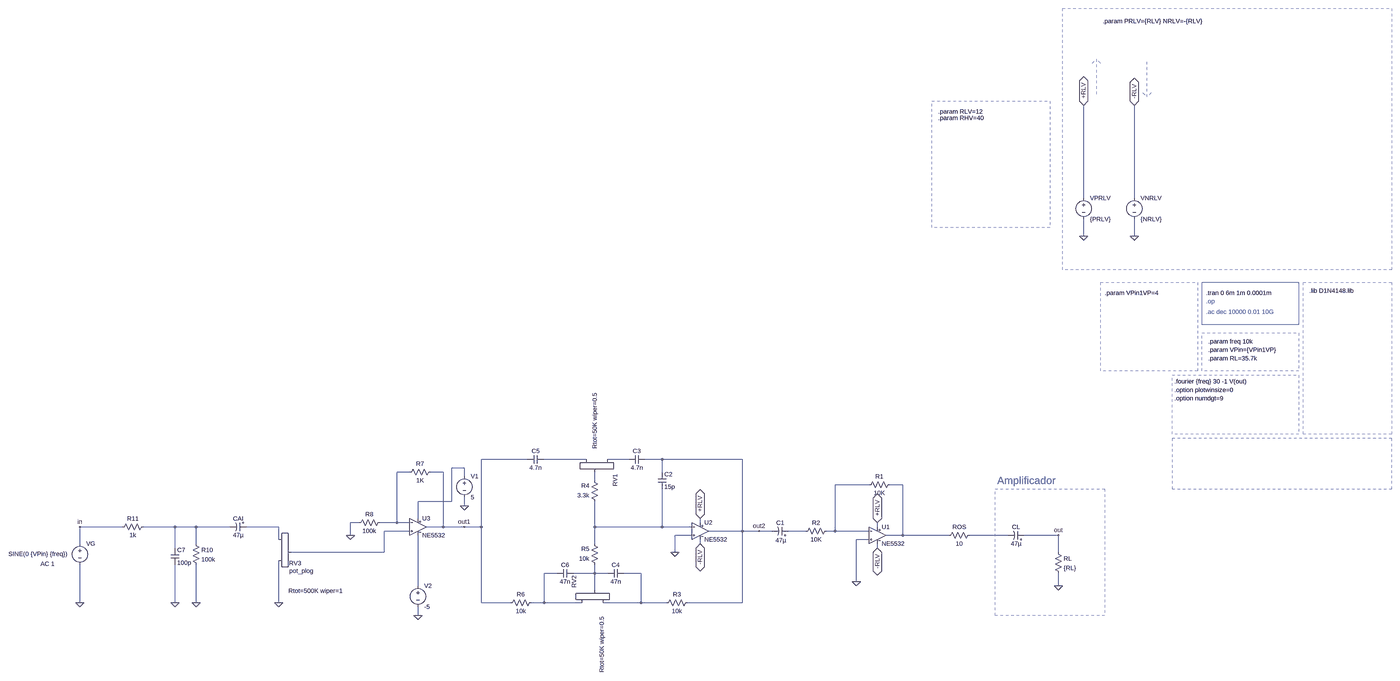
[diagram p0: schematic preamp_V0.1b.asc, whole sheet]
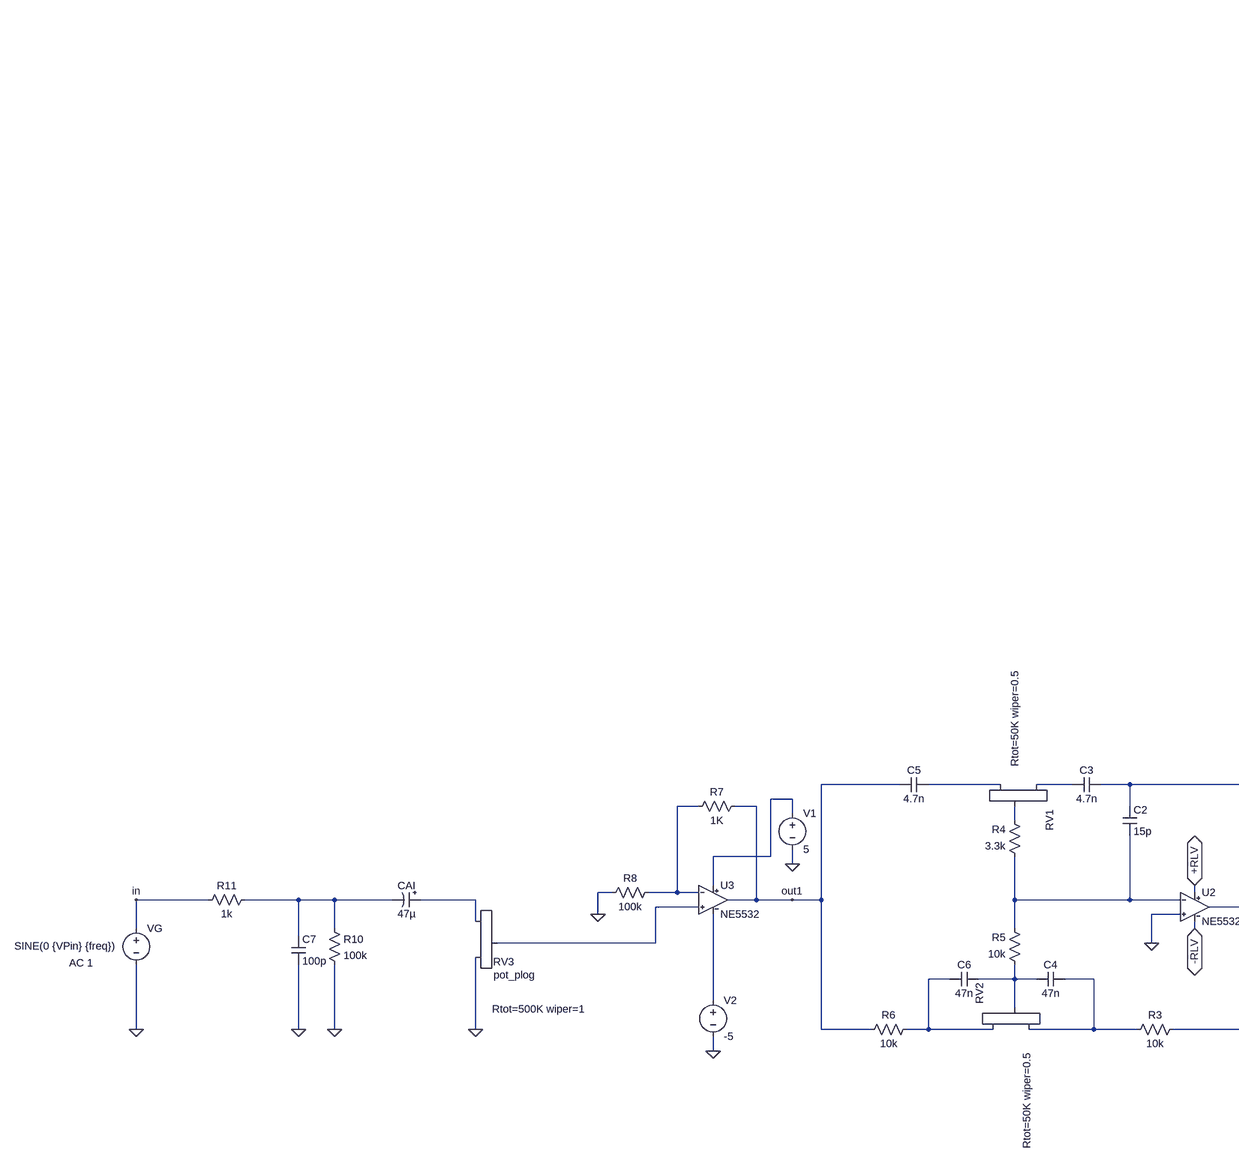
[diagram p1: schematic preamp_V0.1b.asc, part, row 1 of 1, column 1 of 2]
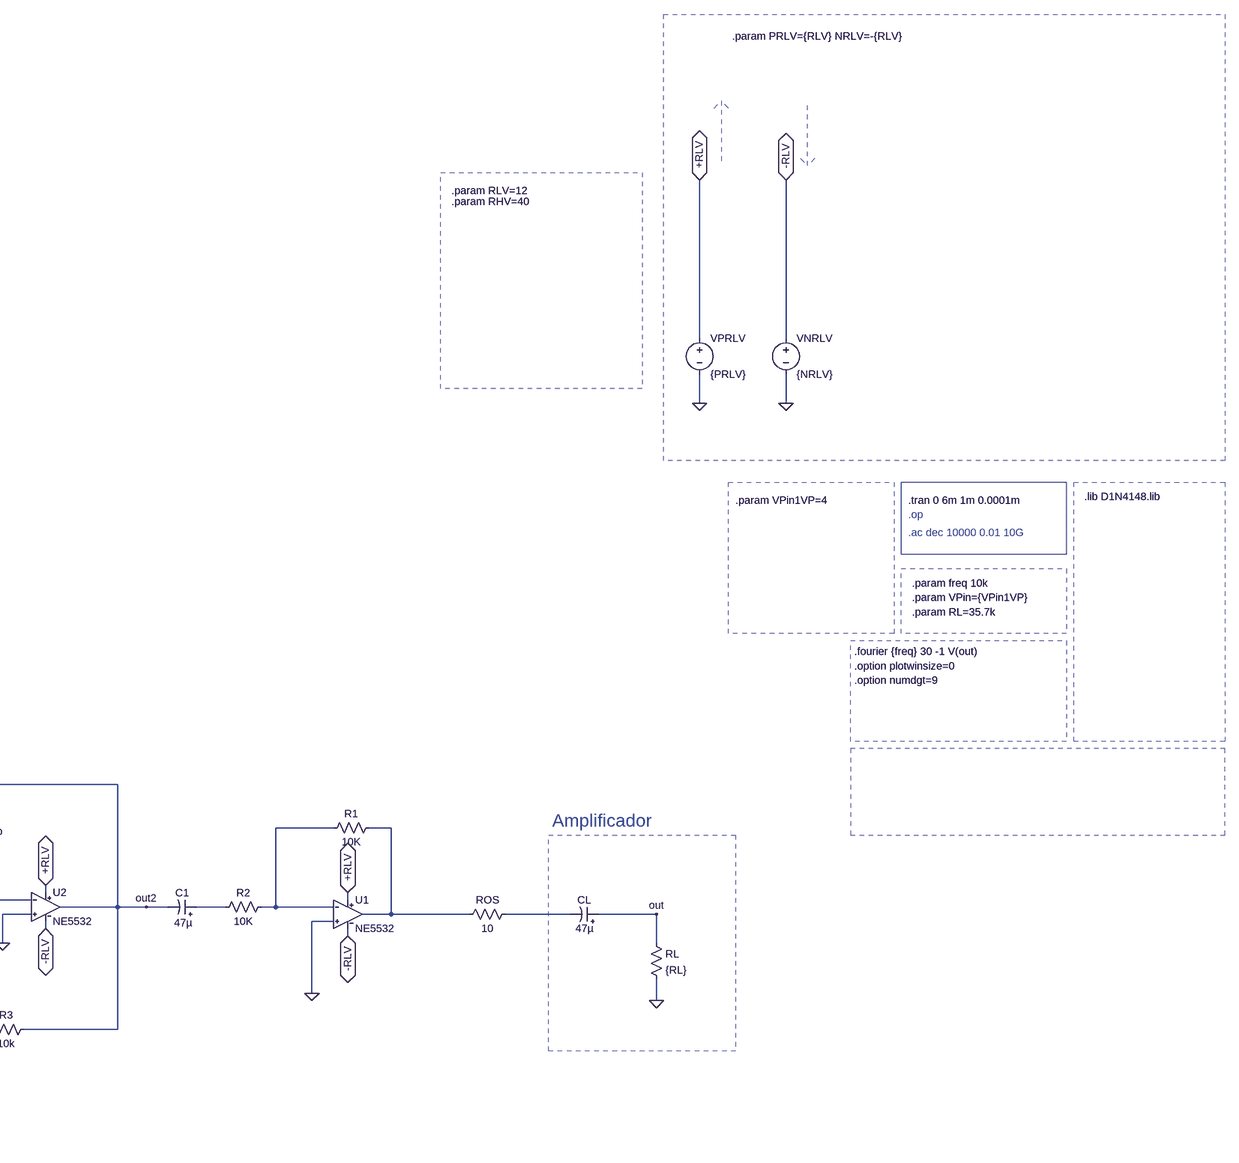
[diagram p2: schematic preamp_V0.1b.asc, part, row 1 of 1, column 2 of 2]
preamp_V0.1b.asc, the LTspice schematic file:
Version 4
SHEET 1 4212 2620
WIRE 1792 -1328 1792 -1680
WIRE 1984 -1328 1984 -1680
WIRE 1792 -1184 1792 -1248
WIRE 1984 -1184 1984 -1248
WIRE -320 -336 -496 -336
WIRE -96 -336 -256 -336
WIRE 64 -336 -16 -336
WIRE 192 -336 128 -336
WIRE 496 -336 192 -336
WIRE -560 -304 -608 -304
WIRE -768 -288 -816 -288
WIRE -640 -288 -688 -288
WIRE 192 -288 192 -336
WIRE -560 -272 -560 -304
WIRE -64 -256 -64 -288
WIRE 976 -240 848 -240
WIRE 1104 -240 1056 -240
WIRE -608 -176 -608 -304
WIRE -608 -176 -736 -176
WIRE -560 -160 -560 -192
WIRE -736 -112 -736 -176
WIRE -960 -96 -992 -96
WIRE -816 -96 -816 -288
WIRE -816 -96 -880 -96
WIRE -768 -96 -816 -96
WIRE 336 -96 336 -112
WIRE -1872 -80 -2048 -80
WIRE -1664 -80 -1792 -80
WIRE -1584 -80 -1664 -80
WIRE -1456 -80 -1584 -80
WIRE -1264 -80 -1392 -80
WIRE -640 -80 -640 -288
WIRE -640 -80 -704 -80
WIRE -560 -80 -640 -80
WIRE -496 -80 -496 -336
WIRE -496 -80 -560 -80
WIRE -64 -80 -64 -176
WIRE 192 -80 192 -224
WIRE 192 -80 -64 -80
WIRE 304 -80 192 -80
WIRE 1008 -80 1008 -96
WIRE -768 -64 -864 -64
WIRE 496 -64 496 -336
WIRE 496 -64 368 -64
WIRE 560 -64 496 -64
WIRE 608 -64 560 -64
WIRE 736 -64 672 -64
WIRE 848 -64 848 -240
WIRE 848 -64 816 -64
WIRE 976 -64 848 -64
WIRE -992 -48 -992 -96
WIRE 304 -48 240 -48
WIRE 1104 -48 1104 -240
WIRE 1104 -48 1040 -48
WIRE 1280 -48 1104 -48
WIRE 1504 -48 1360 -48
WIRE 1696 -48 1568 -48
WIRE -1264 -32 -1264 -80
WIRE 976 -32 928 -32
WIRE -2048 -16 -2048 -80
WIRE -1584 -16 -1584 -80
WIRE -64 -16 -64 -80
WIRE 336 -16 336 -32
WIRE -1664 0 -1664 -80
WIRE 1008 0 1008 -16
WIRE -864 16 -864 -64
WIRE -864 16 -1216 16
WIRE 240 16 240 -48
WIRE 1696 16 1696 -48
WIRE -208 96 -256 96
WIRE -64 96 -64 64
WIRE -64 96 -144 96
WIRE -16 96 -64 96
WIRE 112 96 48 96
WIRE 928 128 928 -32
WIRE -736 144 -736 -48
WIRE 1696 144 1696 96
WIRE -64 160 -64 96
WIRE -2048 208 -2048 64
WIRE -1664 208 -1664 64
WIRE -1584 208 -1584 64
WIRE -1264 208 -1264 48
WIRE -496 208 -496 -80
WIRE -384 208 -496 208
WIRE -256 208 -256 96
WIRE -256 208 -304 208
WIRE -112 208 -256 208
WIRE 112 208 112 96
WIRE 112 208 -32 208
WIRE 208 208 112 208
WIRE 496 208 496 -64
WIRE 496 208 288 208
WIRE -736 256 -736 224
FLAG -2048 208 0
FLAG -2048 -80 in
FLAG 1792 -1184 0
FLAG 1792 -1680 +RLV
IOPIN 1792 -1680 BiDir
FLAG 1984 -1184 0
FLAG 1984 -1680 -RLV
IOPIN 1984 -1680 BiDir
FLAG 928 128 0
FLAG 1008 0 -RLV
IOPIN 1008 0 BiDir
FLAG 1008 -96 +RLV
IOPIN 1008 -96 BiDir
FLAG 1696 144 0
FLAG 1696 -48 out
FLAG -1584 208 0
FLAG -1664 208 0
FLAG -1264 208 0
FLAG 336 -16 -RLV
IOPIN 336 -16 BiDir
FLAG 336 -112 +RLV
IOPIN 336 -112 BiDir
FLAG 240 16 0
FLAG -992 -48 0
FLAG -560 -80 out1
FLAG 560 -64 out2
FLAG -560 -160 0
FLAG -736 256 0
DATAFLAG 2032 -1808 "I(Vnrlv)"
DATAFLAG 1840 -1808 "-I(Vprlv)"
DATAFLAG 1200 -48 ""
DATAFLAG 496 -192 ""
SYMBOL voltage -2048 -32 R0
WINDOW 3 -271 55 Left 2
WINDOW 123 -149 92 Left 2
WINDOW 39 0 0 Left 2
SYMATTR Value SINE(0 {VPin} {freq})
SYMATTR Value2 AC 1
SYMATTR InstName VG
SYMBOL polcap -1392 -96 R90
WINDOW 0 0 32 VBottom 2
WINDOW 3 32 32 VTop 2
SYMATTR InstName CAI
SYMATTR Value 47µ
SYMBOL voltage 1792 -1344 R0
SYMATTR InstName VPRLV
SYMATTR Value {PRLV}
SYMBOL voltage 1984 -1344 R0
SYMATTR InstName VNRLV
SYMATTR Value {NRLV}
SYMBOL res 832 -80 R90
WINDOW 0 0 56 VBottom 2
WINDOW 3 32 56 VTop 2
SYMATTR InstName R2
SYMATTR Value 10K
SYMBOL res 1072 -256 R90
WINDOW 0 0 56 VBottom 2
WINDOW 3 32 56 VTop 2
SYMATTR InstName R1
SYMATTR Value 10K
SYMBOL res 1680 0 R0
SYMATTR InstName RL
SYMATTR Value {RL}
SYMBOL NE5532 1008 -112 R0
SYMATTR InstName U1
SYMBOL potentiometer_standard -1280 -48 R0
WINDOW 0 55 106 Left 2
WINDOW 3 53 211 Left 2
WINDOW 39 51 172 Left 2
WINDOW 38 56 135 Left 2
SYMATTR InstName RV3
SYMATTR Value Rtot=500K wiper=1
SYMATTR SpiceModel pot_plog
SYMBOL res -1600 -32 R0
SYMATTR InstName R10
SYMATTR Value 100k
SYMBOL cap -1680 0 R0
SYMATTR InstName C7
SYMATTR Value 100p
SYMBOL NE5532 -736 -144 R0
SYMATTR InstName U3
SYMBOL NE5532 336 -128 R0
SYMATTR InstName U2
SYMBOL potentiometer_standard 0 -352 R90
WINDOW 3 -238 63 Left 2
WINDOW 39 -212 100 Left 2
WINDOW 38 -131 29 Left 2
SYMATTR Value Rtot=50K wiper=0.5
SYMATTR InstName RV1
SYMBOL cap 176 -288 R0
SYMATTR InstName C2
SYMATTR Value 15p
SYMBOL cap 128 -352 R90
WINDOW 0 0 32 VBottom 2
WINDOW 3 32 32 VTop 2
SYMATTR InstName C3
SYMATTR Value 4.7n
SYMBOL cap -256 -352 R90
WINDOW 0 0 32 VBottom 2
WINDOW 3 32 32 VTop 2
SYMATTR InstName C5
SYMATTR Value 4.7n
SYMBOL cap -144 80 R90
WINDOW 0 0 32 VBottom 2
WINDOW 3 32 32 VTop 2
SYMATTR InstName C6
SYMATTR Value 47n
SYMBOL cap 48 80 R90
WINDOW 0 0 32 VBottom 2
WINDOW 3 32 32 VTop 2
SYMATTR InstName C4
SYMATTR Value 47n
SYMBOL potentiometer_standard -128 224 R270
WINDOW 3 -249 91 Left 2
WINDOW 39 -224 133 Left 2
WINDOW 38 -138 55 Left 2
SYMATTR Value Rtot=50K wiper=0.5
SYMATTR InstName RV2
SYMBOL res 304 192 R90
WINDOW 0 0 56 VBottom 2
WINDOW 3 32 56 VTop 2
SYMATTR InstName R3
SYMATTR Value 10k
SYMBOL res -288 192 R90
WINDOW 0 0 56 VBottom 2
WINDOW 3 32 56 VTop 2
SYMATTR InstName R6
SYMATTR Value 10k
SYMBOL res -48 80 R180
WINDOW 0 36 76 Left 2
WINDOW 3 36 40 Left 2
SYMATTR InstName R5
SYMATTR Value 10k
SYMBOL res -48 -160 R180
WINDOW 0 36 76 Left 2
WINDOW 3 36 40 Left 2
SYMATTR InstName R4
SYMATTR Value 3.3k
SYMBOL res -672 -304 R90
WINDOW 0 0 56 VBottom 2
WINDOW 3 32 56 VTop 2
SYMATTR InstName R7
SYMATTR Value 1K
SYMBOL res -864 -112 R90
WINDOW 0 0 56 VBottom 2
WINDOW 3 32 56 VTop 2
SYMATTR InstName R8
SYMATTR Value 100k
SYMBOL res -1776 -96 R90
WINDOW 0 0 56 VBottom 2
WINDOW 3 32 56 VTop 2
SYMATTR InstName R11
SYMATTR Value 1k
SYMBOL res 1376 -64 R90
WINDOW 0 0 56 VBottom 2
WINDOW 3 32 56 VTop 2
SYMATTR InstName ROS
SYMATTR Value 10
SYMBOL polcap 1568 -32 M270
WINDOW 0 32 32 VTop 2
WINDOW 3 0 32 VBottom 2
SYMATTR InstName CL
SYMATTR Value 47µ
SYMBOL polcap 672 -48 M270
WINDOW 0 32 32 VTop 2
WINDOW 3 -4 30 VBottom 2
SYMATTR InstName C1
SYMATTR Value 47µ
SYMBOL voltage -560 -288 R0
SYMATTR InstName V1
SYMATTR Value 5
SYMBOL voltage -736 128 R0
SYMATTR InstName V2
SYMATTR Value -5
TEXT 2256 -968 Left 2 !.tran 0 6m 1m 0.0001m
TEXT 2264 -784 Left 2 !.param freq 10k
TEXT 2256 -936 Left 2 ;.op
TEXT 2136 -632 Left 2 !.fourier {freq} 30 -1 V(out)
TEXT 2256 -896 Left 2 ;.ac dec 10000 0.01 10G
TEXT 2264 -752 Left 2 !.param VPin={VPin1VP}
TEXT 2136 -600 Left 2 !.option plotwinsize=0
TEXT 2136 -568 Left 2 !.option numdgt=9
TEXT 2264 -720 Left 2 !.param RL=35.7k
TEXT 1240 -1632 Left 2 !.param RHV=40
TEXT 1240 -1656 Left 2 !.param RLV=12
TEXT 1864 -2000 Left 2 !.param PRLV={RLV} NRLV=-{RLV}
TEXT 1872 -968 Left 2 !.param VPin1VP=4
TEXT 2648 -976 Left 2 !.lib D1N4148.lib
TEXT 1464 -256 Left 4 ;Amplificador
LINE Normal 2032 -1712 2032 -1856 2
LINE Normal 2032 -1712 2032 -1712 2
LINE Normal 2032 -1712 2032 -1712 2
LINE Normal 2016 -1728 2032 -1712 2
LINE Normal 2016 -1728 2016 -1728 2
LINE Normal 2048 -1728 2032 -1712 2
LINE Normal 1840 -1856 1840 -1712 2
LINE Normal 1840 -1856 1840 -1856 2
LINE Normal 1840 -1856 1840 -1856 2
LINE Normal 1856 -1840 1840 -1856 2
LINE Normal 1856 -1840 1856 -1840 2
LINE Normal 1824 -1840 1840 -1856 2
RECTANGLE Normal 2608 -848 2240 -1008
RECTANGLE Normal 2608 -672 2240 -816 3
RECTANGLE Normal 2960 -432 2624 -1008 2
RECTANGLE Normal 2608 -432 2128 -656 3
RECTANGLE Normal 2128 -224 2960 -416 3
RECTANGLE Normal 2960 -1056 1712 -2048 4
RECTANGLE Normal 1664 -1216 1216 -1696 2
RECTANGLE Normal 2224 -672 1856 -1008 3
RECTANGLE Normal 1872 256 1456 -224 2

The netlist it stands for:
* preamp_V0.1b.asc
VG in 0 SINE(0 {VPin} {freq}) AC 1
CAI N009 N008 47µ
VPRLV +RLV 0 {PRLV}
VNRLV -RLV 0 {NRLV}
R2 N006 N012 10K
R1 N007 N006 10K
RL out 0 {RL}
XU1 0 N006 +RLV -RLV N007 NE5532 NE5532  ; pins In+ In- V+ V- OUT
XRV3 N009 0 N011 pot_plog Rtot=500K wiper=1
R10 N008 0 100k
C7 N008 0 100p
XU3 N011 N004 N003 N017 out1 NE5532 NE5532  ; pins In+ In- V+ V- OUT
XU2 0 N010 +RLV -RLV out2 NE5532 NE5532  ; pins In+ In- V+ V- OUT
XRV1 N002 N001 N005 Rtot=50K wiper=0.5
C2 out2 N010 15p
C3 out2 N002 4.7n
C5 N001 out1 4.7n
C6 N015 N014 47n
C4 N016 N015 47n
XRV2 N014 N016 N015 Rtot=50K wiper=0.5
R3 out2 N016 10k
R6 N014 out1 10k
R5 N015 N010 10k
R4 N010 N005 3.3k
R7 out1 N004 1K
R8 N004 0 100k
R11 N008 in 1k
ROS N013 N007 10
CL out N013 47µ
C1 N012 out2 47µ
V1 N003 0 5
V2 N017 0 -5
.tran 0 6m 1m 0.0001m
.param freq 10k
* .op
.fourier {freq} 30 -1 V(out)
* .ac dec 10000 0.01 10G
.param VPin={VPin1VP}
.option plotwinsize=0
.option numdgt=9
.param RL=35.7k
.param RHV=40
.param RLV=12
.param PRLV={RLV} NRLV=-{RLV}
.param VPin1VP=4
.lib D1N4148.lib
* Amplificador
.lib NE5532.mod
.backanno
.end